# Altium schematic sheet CONNECTOR_INTERFACE.SchDoc
size 420 x 297 mm; SheetNumber: 8; SheetTotal: 32
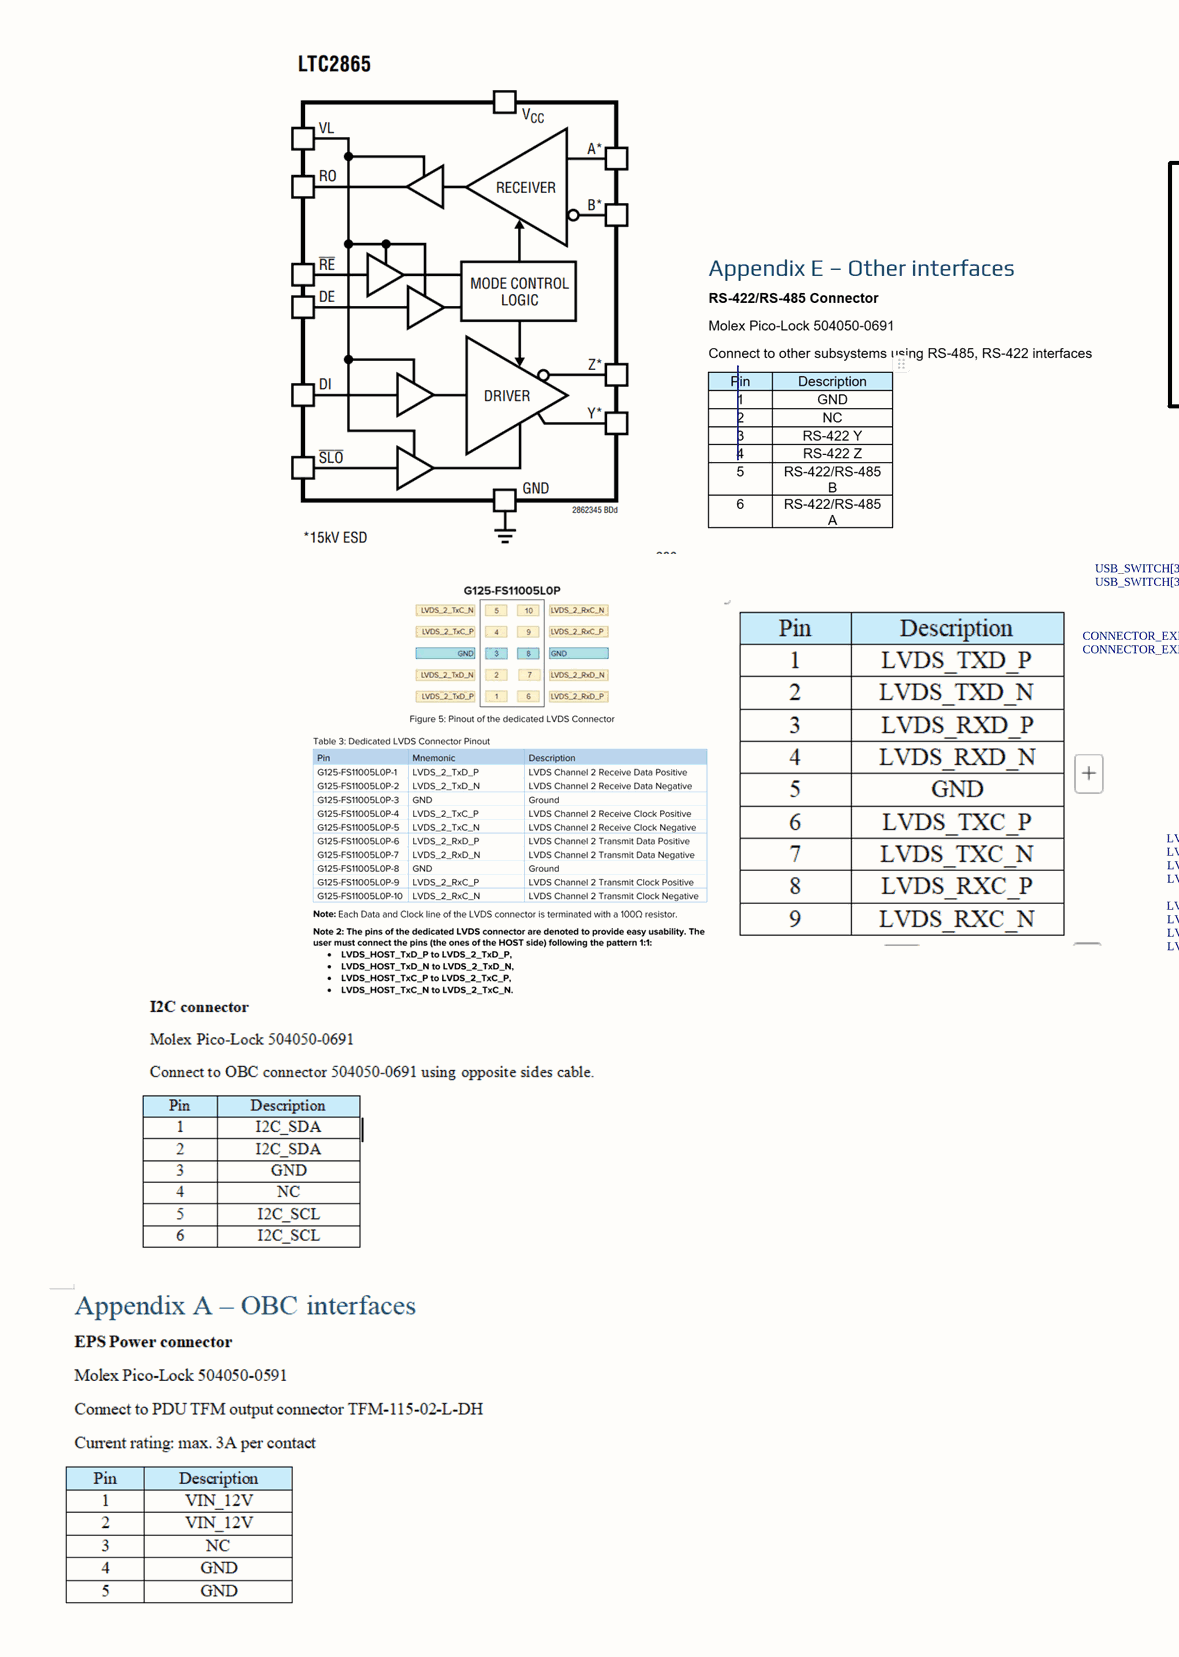
[diagram p0: CONNECTOR_INTERFACE.SchDoc, left]
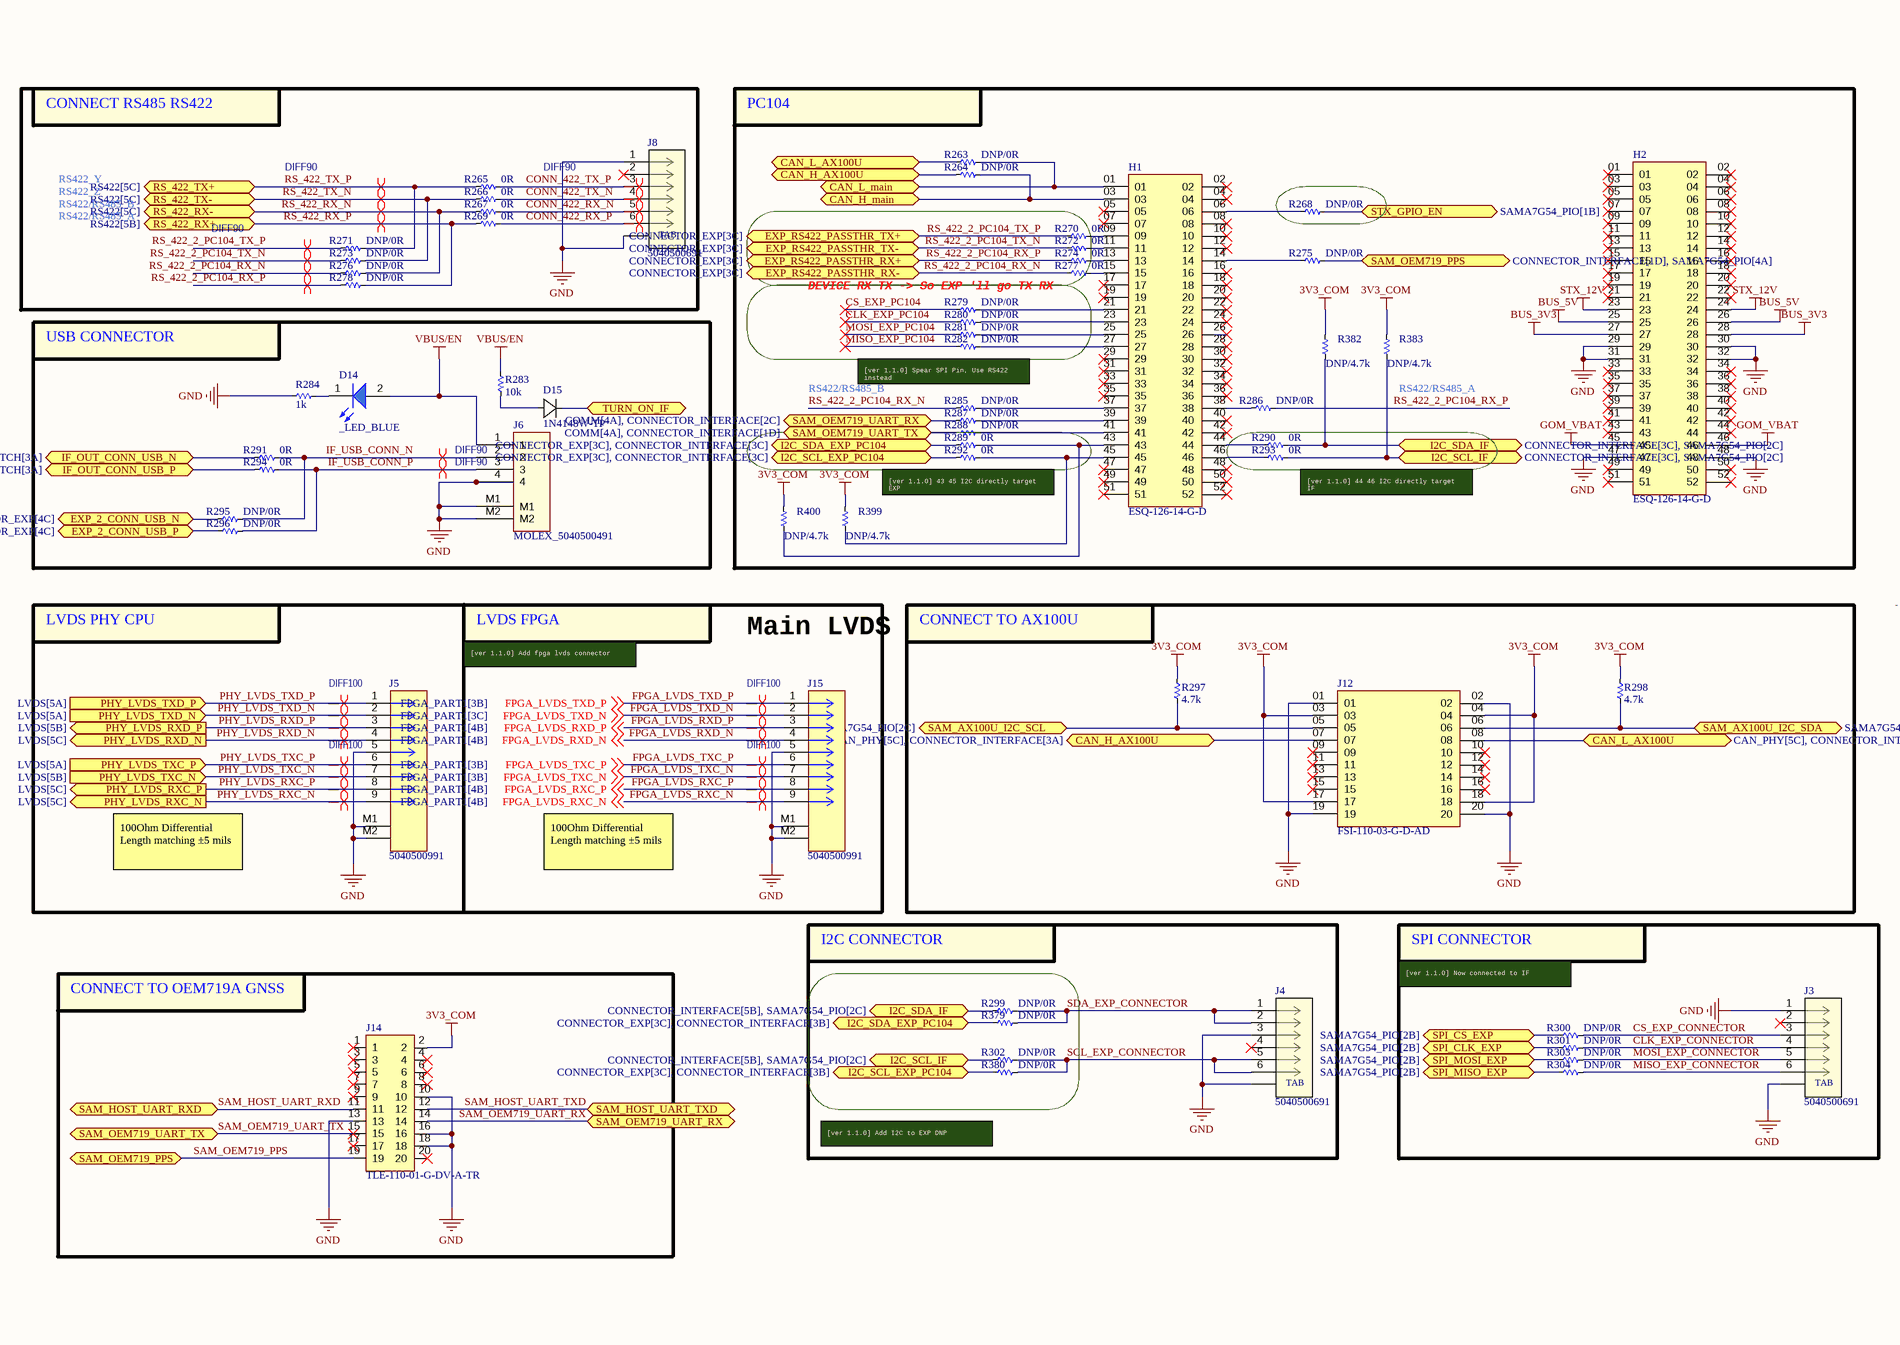
[diagram p1: CONNECTOR_INTERFACE.SchDoc, middle]
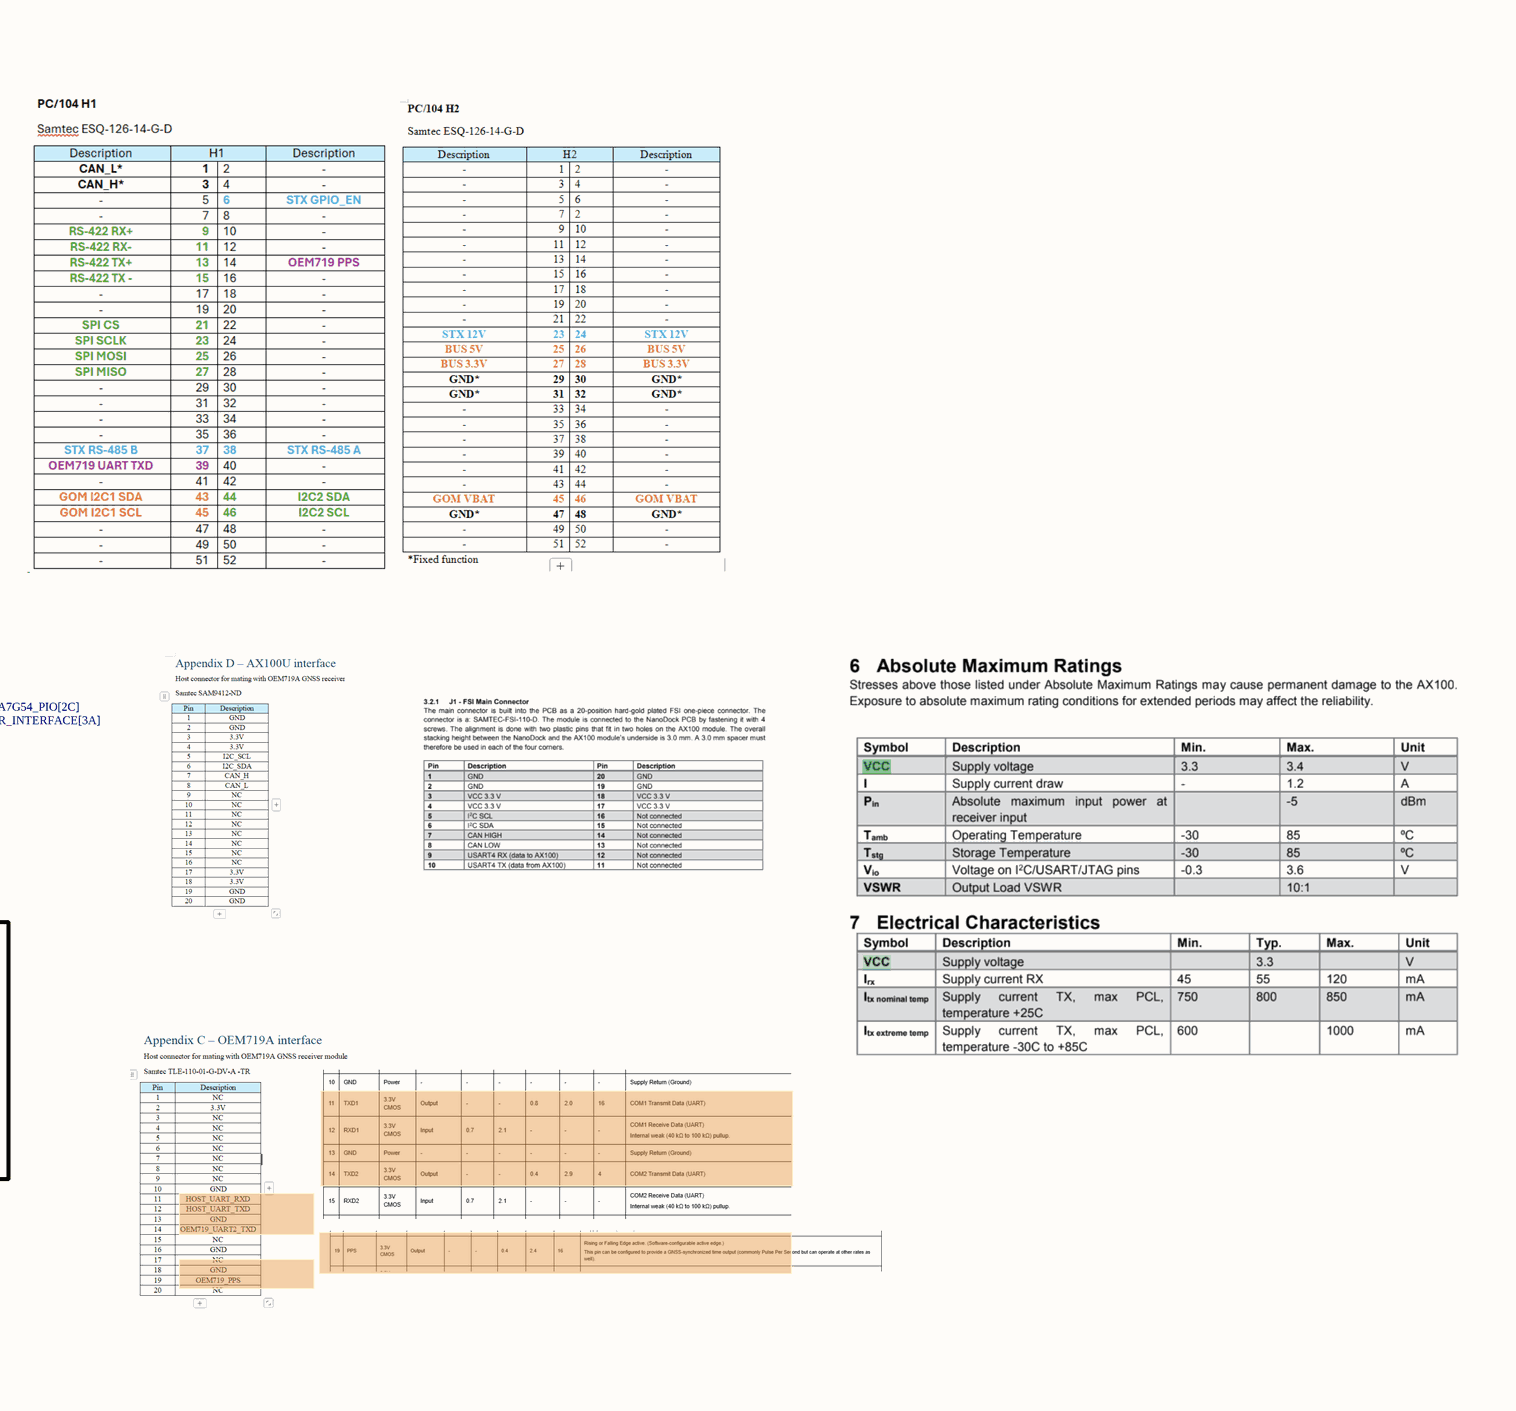
[diagram p2: CONNECTOR_INTERFACE.SchDoc, right]

## Parts
D14  _LED_BLUE  [LED_0603]
D15  1N4148W-TP  [SOD123_MCC]
H1  ESQ-126-14-G-D  [SAMTEC_ESQ-126-14-G-D]
H2  ESQ-126-14-G-D  [SAMTEC_ESQ-126-14-G-D]
J3  5040500691  [5040500691]
J4  5040500691  [5040500691]
J5  5040500991  [MOLEX_5040500991]
J6  MOLEX_5040500491  [MOLEX_5040500491]
J8  5040500691  [5040500691]
J12  FSI-110-03-G-D-AD  [SAMTEC_FSI-110-03-X-D-AD-TR]
J14  TLE-110-01-G-DV-A-TR  [SAMTEC-TLE-110-01-X-DV-A]
J15  5040500991  [MOLEX_5040500991]
R263  DNP/0R  [RES_C_1005x30_L]
R264  DNP/0R  [RES_C_1005x30_L]
R265  0R  [RES_C_1005x30_L]
R266  0R  [RES_C_1005x30_L]
R267  0R  [RES_C_1005x30_L]
R268  DNP/0R  [RES_C_1005x30_L]
R269  0R  [RES_C_1005x30_L]
R270  0R  [RES_C_1005x30_L]
R271  DNP/0R  [RES_C_1005x30_L]
R272  0R  [RES_C_1005x30_L]
R273  DNP/0R  [RES_C_1005x30_L]
R274  0R  [RES_C_1005x30_L]
R275  DNP/0R  [RES_C_1005x30_L]
R276  DNP/0R  [RES_C_1005x30_L]
R277  0R  [RES_C_1005x30_L]
R278  DNP/0R  [RES_C_1005x30_L]
R279  DNP/0R  [RES_C_1005x30_L]
R280  DNP/0R  [RES_C_1005x30_L]
R281  DNP/0R  [RES_C_1005x30_L]
R282  DNP/0R  [RES_C_1005x30_L]
R283  10k  [RES_C_1005x30_L]
R284  1k  [RES_C_1005x30_L]
R285  DNP/0R  [RES_C_1005x30_L]
R286  DNP/0R  [RES_C_1005x30_L]
R287  DNP/0R  [RES_C_1005x30_L]
R288  DNP/0R  [RES_C_1005x30_L]
R289  0R  [RES_C_1005x30_L]
R290  0R  [RES_C_1005x30_L]
R291  0R  [RES_C_1005x30_L]
R292  0R  [RES_C_1005x30_L]
R293  0R  [RES_C_1005x30_L]
R294  0R  [RES_C_1005x30_L]
R295  DNP/0R  [RES_C_1005x30_L]
R296  DNP/0R  [RES_C_1005x30_L]
R297  4.7k  [RES_C_1005x30_L]
R298  4.7k  [RES_C_1005x30_L]
R299  DNP/0R  [RES_C_1005x30_L]
R300  DNP/0R  [RES_C_1005x30_L]
R301  DNP/0R  [RES_C_1005x30_L]
R302  DNP/0R  [RES_C_1005x30_L]
R303  DNP/0R  [RES_C_1005x30_L]
R304  DNP/0R  [RES_C_1005x30_L]
R379  DNP/0R  [RES_C_1005x30_L]
R380  DNP/0R  [RES_C_1005x30_L]
R382  DNP/4.7k  [RES_C_1005x30_L]
R383  DNP/4.7k  [RES_C_1005x30_L]
R399  DNP/4.7k  [RES_C_1005x30_L]
R400  DNP/4.7k  [RES_C_1005x30_L]

## Blocks framed on the sheet
CONNECT RS485 RS422: J8 R265-R267 R269 R271 R273 R276 R278
PC104: H1 H2 R263 R264 R268 R275 R279-R282 R285-R290 R292 R293 R382 R383 R399 R400
DEVICE RX TX -> So EXP 'll go TX RX: R270 R272 R274 R277
USB CONNECTOR: D14 D15 J6 R283 R284 R291 R294-R296
Main LVDS: J5 J15
CONNECT TO AX100U: J12 R297 R298
I2C CONNECTOR: J4 R299 R302 R379 R380
SPI CONNECTOR: J3 R300 R301 R303 R304
CONNECT TO OEM719A GNSS: J14

## Ports
CAN_H_AX100U (bidir, see CAN_PHY[5C], CONNECTOR_INTERFACE[3A]), CAN_H_AX100U (bidir, see CAN_PHY[5C], CONNECTOR_INTERFACE[4B]), CAN_H_main (bidir, see CAN_PHY[5A], CONNECTOR_EXP[3B]), CAN_L_AX100U (bidir, see CAN_PHY[5C], CONNECTOR_INTERFACE[3A]), CAN_L_AX100U (bidir, see CAN_PHY[5C], CONNECTOR_INTERFACE[5B]), CAN_L_main (bidir, see CAN_PHY[5A], CONNECTOR_EXP[3B]), EXP_2_CONN_USB_N (bidir, see CONNECTOR_EXP[4C]), EXP_2_CONN_USB_P (bidir, see CONNECTOR_EXP[4C]), EXP_RS422_PASSTHR_RX+ (bidir, see CONNECTOR_EXP[3C]), EXP_RS422_PASSTHR_RX- (bidir, see CONNECTOR_EXP[3C]), EXP_RS422_PASSTHR_TX+ (bidir, see CONNECTOR_EXP[3C]), EXP_RS422_PASSTHR_TX- (bidir, see CONNECTOR_EXP[3C]), I2C_SCL_EXP_PC104 (bidir, see CONNECTOR_EXP[3C], CONNECTOR_INTERFACE[3B]), I2C_SCL_EXP_PC104 (bidir, see CONNECTOR_EXP[3C], CONNECTOR_INTERFACE[3C]), I2C_SCL_IF (bidir, see CONNECTOR_INTERFACE[3C], SAMA7G54_PIO[2C]), I2C_SCL_IF (bidir, see CONNECTOR_INTERFACE[5B], SAMA7G54_PIO[2C]), I2C_SDA_EXP_PC104 (bidir, see CONNECTOR_EXP[3C], CONNECTOR_INTERFACE[3B]), I2C_SDA_EXP_PC104 (bidir, see CONNECTOR_EXP[3C], CONNECTOR_INTERFACE[3C]), I2C_SDA_IF (bidir, see CONNECTOR_INTERFACE[3C], SAMA7G54_PIO[2C]), I2C_SDA_IF (bidir, see CONNECTOR_INTERFACE[5B], SAMA7G54_PIO[2C]), IF_OUT_CONN_USB_N (bidir, see USB_SWITCH[3A]), IF_OUT_CONN_USB_P (bidir, see USB_SWITCH[3A]), PHY_LVDS_RXC_N (out, see LVDS[5C]), PHY_LVDS_RXC_P (out, see LVDS[5C]), PHY_LVDS_RXD_N (out, see LVDS[5C]), PHY_LVDS_RXD_P (out, see LVDS[5B]), PHY_LVDS_TXC_N (in, see LVDS[5B]), PHY_LVDS_TXC_P (in, see LVDS[5A]), PHY_LVDS_TXD_N (in, see LVDS[5A]), PHY_LVDS_TXD_P (in, see LVDS[5A]), RS_422_RX+ (bidir, see RS422[5B]), RS_422_RX- (bidir, see RS422[5C]), RS_422_TX+ (bidir, see RS422[5C]), RS_422_TX- (bidir, see RS422[5C]), SAM_AX100U_I2C_SCL (bidir, see SAMA7G54_PIO[2C]), SAM_AX100U_I2C_SDA (bidir, see SAMA7G54_PIO[2C]), SAM_HOST_UART_RXD (bidir, see COMM[4A]), SAM_HOST_UART_TXD (bidir, see COMM[4A]), SAM_OEM719_PPS (bidir, see CONNECTOR_INTERFACE[1D], SAMA7G54_PIO[4A]), SAM_OEM719_PPS (bidir, see CONNECTOR_INTERFACE[5A], SAMA7G54_PIO[4A]), SAM_OEM719_UART_RX (bidir, see COMM[4A], CONNECTOR_INTERFACE[2C]), SAM_OEM719_UART_RX (bidir, see COMM[4A], CONNECTOR_INTERFACE[3B]), SAM_OEM719_UART_TX (bidir, see COMM[4A], CONNECTOR_INTERFACE[1D]), SAM_OEM719_UART_TX (bidir, see COMM[4A], CONNECTOR_INTERFACE[3B]), SPI_CLK_EXP (bidir, see SAMA7G54_PIO[2B]), SPI_CS_EXP (bidir, see SAMA7G54_PIO[2B]), SPI_MISO_EXP (bidir, see SAMA7G54_PIO[2B]), SPI_MOSI_EXP (bidir, see SAMA7G54_PIO[2B]), STX_GPIO_EN (bidir, see SAMA7G54_PIO[1B]), TURN_ON_IF (bidir, see CONNECTOR_EXP[4B], Power[1B], Power[2A])

## Nets
3V3_COM: J12.03 J12.04 J12.17 J12.18 J14.2 R297.2 R298.2 R382.2 R383.2 R399.2 R400.2
BUS_3V3: H2.27 H2.28
BUS_5V: H2.25 H2.26
GND: H2.29 H2.30 H2.31 H2.32 H2.47 H2.48 J3.1 J3.7 J4.3 J4.7 J5.5 J5.M1 J5.M2 J6.4 J6.M1 J6.M2 J8.1 J8.7 J12.01 J12.02 J12.19 J12.20 J14.10 J14.13 J14.16 J14.18 J15.5 J15.M1 J15.M2 R284.1
GOM_VBAT: H2.45 H2.46
STX_12V: H2.23 H2.24
VBUS/EN: D14.2(A) J6.1 R283.1
CAN_H_AX100U: J12.07 R264.1 ; port CAN_H_AX100U
CAN_H_main: H1.03 R264.2 ; port CAN_H_main
CAN_L_AX100U: J12.08 R263.1 ; port CAN_L_AX100U
CAN_L_main: H1.01 R263.2 ; port CAN_L_main
CLK_EXP_CONNECTOR: J3.4 R301.2
CLK_EXP_PC104: R280.1
CONN_422_RX_N: J8.5 R267.2
CONN_422_RX_P: J8.6 R269.2
CONN_422_TX_N: J8.4 R266.2
CONN_422_TX_P: J8.3 R265.2
CS_EXP_CONNECTOR: J3.3 R300.2
CS_EXP_PC104: R279.1
EXP_2_CONN_USB_N: R295.1 ; port EXP_2_CONN_USB_N
EXP_2_CONN_USB_P: R296.1 ; port EXP_2_CONN_USB_P
FPGA_LVDS_RXC_N: J15.9 ; off-sheet FPGA_LVDS_RXC_N
FPGA_LVDS_RXC_P: J15.8 ; off-sheet FPGA_LVDS_RXC_P
FPGA_LVDS_RXD_N: J15.4 ; off-sheet FPGA_LVDS_RXD_N
FPGA_LVDS_RXD_P: J15.3 ; off-sheet FPGA_LVDS_RXD_P
FPGA_LVDS_TXC_N: J15.7 ; off-sheet FPGA_LVDS_TXC_N
FPGA_LVDS_TXC_P: J15.6 ; off-sheet FPGA_LVDS_TXC_P
FPGA_LVDS_TXD_N: J15.2 ; off-sheet FPGA_LVDS_TXD_N
FPGA_LVDS_TXD_P: J15.1 ; off-sheet FPGA_LVDS_TXD_P
I2C_SCL_EXP_PC104: R292.1 R380.1 ; port I2C_SCL_EXP_PC104
I2C_SCL_IF: R293.2 R302.1 R383.1 ; port I2C_SCL_IF
I2C_SDA_EXP_PC104: R289.1 R379.1 ; port I2C_SDA_EXP_PC104
I2C_SDA_IF: R290.2 R299.1 R382.1 ; port I2C_SDA_IF
IF_OUT_CONN_USB_N: R291.1 ; port IF_OUT_CONN_USB_N
IF_OUT_CONN_USB_P: R294.1 ; port IF_OUT_CONN_USB_P
IF_USB_CONN_N: J6.2 R291.2 R295.2
IF_USB_CONN_P: J6.3 R294.2 R296.2
MISO_EXP_CONNECTOR: J3.6 R304.2
MISO_EXP_PC104: R282.1
MOSI_EXP_CONNECTOR: J3.5 R303.2
MOSI_EXP_PC104: R281.1
PHY_LVDS_RXC_N: J5.9 ; port PHY_LVDS_RXC_N
PHY_LVDS_RXC_P: J5.8 ; port PHY_LVDS_RXC_P
PHY_LVDS_RXD_N: J5.4 ; port PHY_LVDS_RXD_N
PHY_LVDS_RXD_P: J5.3 ; port PHY_LVDS_RXD_P
PHY_LVDS_TXC_N: J5.7 ; port PHY_LVDS_TXC_N
PHY_LVDS_TXC_P: J5.6 ; port PHY_LVDS_TXC_P
PHY_LVDS_TXD_N: J5.2 ; port PHY_LVDS_TXD_N
PHY_LVDS_TXD_P: J5.1 ; port PHY_LVDS_TXD_P
RS_422_2_PC104_RX_N: R276.1 R277.1 R285.1 ; port EXP_RS422_PASSTHR_RX-
RS_422_2_PC104_RX_P: R274.1 R278.1 R286.2 ; port EXP_RS422_PASSTHR_RX+
RS_422_2_PC104_TX_N: R272.1 R273.1 ; port EXP_RS422_PASSTHR_TX-
RS_422_2_PC104_TX_P: R270.1 R271.1 ; port EXP_RS422_PASSTHR_TX+
RS_422_RX_N: R267.1 R276.2 ; port RS_422_RX-
RS_422_RX_P: R269.1 R278.2 ; port RS_422_RX+
RS_422_TX_N: R266.1 R273.2 ; port RS_422_TX-
RS_422_TX_P: R265.1 R271.2 ; port RS_422_TX+
SAM_AX100U_I2C_SCL: J12.05 R297.1 ; port SAM_AX100U_I2C_SCL
SAM_AX100U_I2C_SDA: J12.06 R298.1 ; port SAM_AX100U_I2C_SDA
SAM_HOST_UART_RXD: J14.11 ; port SAM_HOST_UART_RXD
SAM_HOST_UART_TXD: J14.12 ; port SAM_HOST_UART_TXD
SAM_OEM719_PPS: J14.19 R275.2 ; port SAM_OEM719_PPS
SAM_OEM719_UART_RX: J14.14 R287.1 ; port SAM_OEM719_UART_RX
SAM_OEM719_UART_TX: J14.15 R288.1 ; port SAM_OEM719_UART_TX
SCL_EXP_CONNECTOR: J4.5 J4.6 R302.2 R380.2
SDA_EXP_CONNECTOR: J4.1 J4.2 R299.2 R379.2
SPI_CLK_EXP: R301.1 ; port SPI_CLK_EXP
SPI_CS_EXP: R300.1 ; port SPI_CS_EXP
SPI_MISO_EXP: R304.1 ; port SPI_MISO_EXP
SPI_MOSI_EXP: R303.1 ; port SPI_MOSI_EXP
STX_GPIO_EN: R268.2 ; port STX_GPIO_EN
TURN_ON_IF: D15.1 ; port TURN_ON_IF
NetD14_1: D14.1(K) R284.2
NetD15_2: D15.2 R283.2
NetH1_06: H1.06 R268.1
NetH1_09: H1.09 R270.2
NetH1_11: H1.11 R272.2
NetH1_13: H1.13 R274.2
NetH1_14: H1.14 R275.1
NetH1_15: H1.15 R277.2
NetH1_21: H1.21 R279.2
NetH1_23: H1.23 R280.2
NetH1_25: H1.25 R281.2
NetH1_27: H1.27 R282.2
NetH1_37: H1.37 R285.2
NetH1_38: H1.38 R286.1
NetH1_39: H1.39 R287.2
NetH1_41: H1.41 R288.2
NetH1_43: H1.43 R289.2 R400.1
NetH1_44: H1.44 R290.1
NetH1_45: H1.45 R292.2 R399.1
NetH1_46: H1.46 R293.1

Not connected (* = marked no-connect by the designer): H1 02* 04* 05* 07* 08* 10* 12* 16* 17* 18* 19* 20* 22* 24* 26* 28* 29* 30* 31* 32* 33* 34* 35* 36* 40* 42* 47* 48* 49* 50* 51* 52*; H2 01* 02* 03* 04* 05* 06* 07* 08* 09* 10* 11* 12* 13* 14* 15* 16* 17* 18* 19* 20* 21* 22* 33* 34* 35* 36* 37* 38* 39* 40* 41* 42* 43* 44* 49* 50* 51* 52*; J3 2*; J4 4*; J8 2*; J12 09* 10* 11* 12* 13* 14* 15* 16*; J14 1* 3* 4* 5* 6* 7* 8* 9* 17* 20*

## Layout directives
differential pair; differential pair class DIFF90; net class DIFF90; rule Matched Net Lengths [Tolerance = 4mil]: CONN_422_RX_N, CONN_422_RX_P, CONN_422_TX_N, CONN_422_TX_P, IF_USB_CONN_N, IF_USB_CONN_P, RS_422_2_PC104_RX_N, RS_422_2_PC104_RX_P, RS_422_2_PC104_TX_N, RS_422_2_PC104_TX_P, RS_422_RX_N, RS_422_RX_P, RS_422_TX_N, RS_422_TX_P
differential pair; differential pair class DIFF100; net class DIFF100; rule Matched Net Lengths [Tolerance = 4mil]: FPGA_LVDS_RXC_N, FPGA_LVDS_RXC_P, FPGA_LVDS_RXD_N, FPGA_LVDS_RXD_P, FPGA_LVDS_TXC_N, FPGA_LVDS_TXC_P, FPGA_LVDS_TXD_N, FPGA_LVDS_TXD_P, PHY_LVDS_RXC_N, PHY_LVDS_RXC_P, PHY_LVDS_RXD_N, PHY_LVDS_RXD_P, PHY_LVDS_TXC_N, PHY_LVDS_TXC_P, PHY_LVDS_TXD_N, PHY_LVDS_TXD_P

## Notes on the sheet
- RS422/RS485_A
- RS422/RS485_B
- RS422_Z
- RS422_Y
- (near R282) [ver 1.1.0] Spear SPI Pin, Use RS422 instead
- (near R383) RS422/RS485_A
- (near R292) [ver 1.1.0] 43 45 I2C directly target EXP
- [ver 1.1.0] 44 46 I2C directly target IF
- LVDS PHY CPU
- LVDS FPGA
- [ver 1.1.0] Add fpga lvds connector
- 100Ohm Differential
  Length matching ±5 mils
- [ver 1.1.0] Now connected to IF
- [ver 1.1.0] Add I2C to EXP DNP
- Project:
- Sub-system:
- Design by:
- Sheet title:
- Sheet
- A3
- of
- Checked by:
- Approved by:
- Revision:
- Document No:
- Size:
- Date:
- (in symbol 5040500691) TAB

## Library data of the parts
D14 = LED_BLUE: LED BLUE CLEAR 0603 SMD
D15 = 1N4148W-TP: Description; Manufacturer_Name: MCC; Copyright: Copyright (C) 2026 Ultra Librarian. All rights reserved.; Manufacturer_Part_Number: 1N4148W-TP
H1 H2 = ESQ-126-14-G-D: CONN SOCKET 52POS 0.1 GOLD PCB; MF: Samtec; MP: ESQ-126-14-G-D; Price: None; Package: None; Value: *; Availability: Unavailable
J3 J4 J8 = 5040500691: 1.50mm Pitch, Pico-Lock PCB Header, Single Row, Right-Angle, Surface Mount, Gold (Au) Plating, Positive Lock, 6 Circuits, Tape and Reel; Manufacturer_Name: Molex Connector Corporation; Copyright: Copyright (C) 2025 Ultra Librarian. All rights reserved.; Manufacturer_Part_Number: 5040500691; Datasheet: https://www.molex.com/en-us/products/part-detail-pdf/5040500691?display=pdf; RefDes: RefDes; Type: Type
J5 J15 = 5040500991: Connector Header Surface Mount, Right Angle 9 position 0.059" (1.50mm)
J6 = Header 4x1_2M
J12 = FSI-110-03-X-D-AD-TR: CONN STACKING 20POS SMD GOLD; Price: None; Value: *; Package: None; MP: FSI-110-03-X-D-AD-TR; Availability: Unavailable
J14 = SAMTEC-TLE-110-01-X-DV-A: CONN RCPT 20POS 0.079 GOLD SMD; Availability: Unavailable; MP: SAMTEC-TLE-110-01-X-DV-A; Price: None; Value: *; Package: None
R263-R304 R379 R380 R382 R383 R399 R400 = _RES_B_2: RES